# Altium schematic sheet Power System2.SchDoc
size A; SheetNumber: 1; SheetTotal: 1
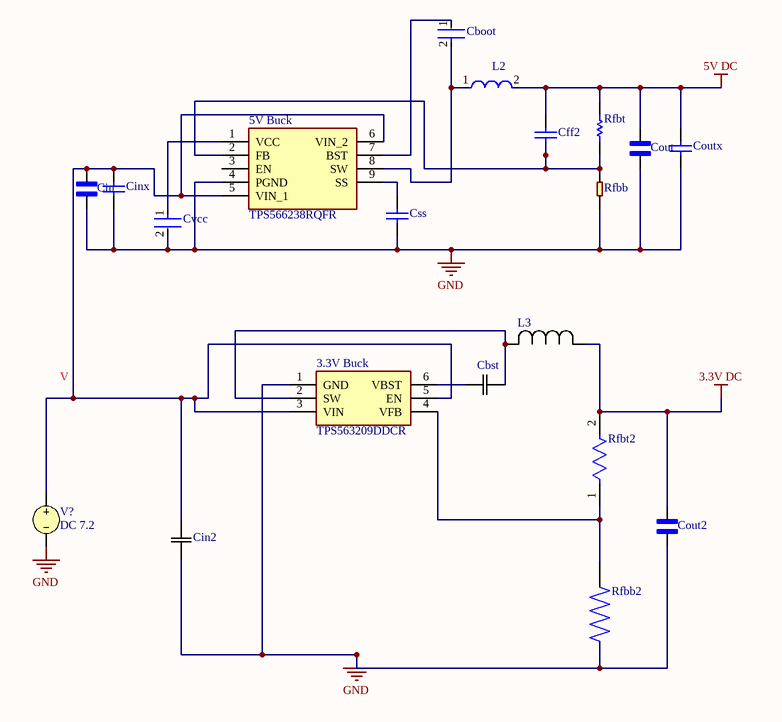
[diagram p0: Power System2.SchDoc]

## Parts
3.3V_Buck  TPS563209DDCR  [SOT95P280X110-6N]
5V_Buck  TPS566238RQFR  [TPS566238RQFR]
Cboot  GRM155R71C104KA88D  [FP-GRM15-MFG]  (value not drawn)
Cbst  08053C104KAT2A  [CAP_X7R_0805_AVX]  (value not drawn)
Cff2  06033A330JAT2A  [CAPC1608X90X35LL15T15]  (value not drawn)
Cin  MSASE21GBB5226MTNA01  [CAPC2012X145N]  (value not drawn)
Cin2  MSAST219LB5106KTNA01  [CAP_MSAS21-9_TAY]  (value not drawn)
Cinx  GRM188R71H104KA93D  [CAPC1608X90X35ML10T15]  (value not drawn)
Cout  LMK212BJ226MG-T  [CAPC2012X135N]  (value not drawn)
Cout2  GRM188R60J226MEA0D  [CAPC1608X100N]  (value not drawn)
Coutx  GRM188R71E104KA01D  [CAPC1608X90X35LL10T15]  (value not drawn)
Css  GRM155R71C103KA01D  [CAPC1005X55X25LL05T10]  (value not drawn)
Cvcc  EMK107B7105KA-T  [FP-0603-L_1_6_0_1-W_0_8_0-IPC_C]  (value not drawn)
L2  XAL5030-222MEB  [FP-XAL5030-222MEB-MFG]  (value not drawn)
L3  SRN8040-2R2Y  [IND_BOURNS_SRN8040]  (value not drawn)
Rfbb  SMD-RES-30K-1%-1/10W(0603)  [R0603]  (value not drawn)
Rfbb2  M55342K11B10E0RS3  [RESC0905X41N]  (value not drawn)
Rfbt  RC0603FR-07220KL  [RESC1608X55X25ML10T15]  (value not drawn)
Rfbt2  CRCW040233K2FKED  [Vishay_CRCW0402-e3_MFG]  (value not drawn)
V?  DC 7.2

## Nets
3.3V DC: Cout2.2 L3.1 Rfbt2.2
5V DC: Cff2.2 Cout.2 Coutx.2 L2.2 Rfbt.2
GND: 3.3V_Buck.1(GND) 5V_Buck.4(PGND) Cin.1 Cin2.1 Cinx.1 Cout.1 Cout2.1 Coutx.1 Css.1 Cvcc.2 Rfbb.1 Rfbb2.1 V?.2
Net3.3V_Buck_2: 3.3V_Buck.2(SW) Cbst.2 L3.2
Net3.3V_Buck_3: 3.3V_Buck.3(VIN) 3.3V_Buck.5(EN) 5V_Buck.5(VIN_1) 5V_Buck.6(VIN_2) Cin.2 Cin2.2 Cinx.2 V?.1
Net3.3V_Buck_4: 3.3V_Buck.4(VFB) Rfbb2.2 Rfbt2.1
Net3.3V_Buck_6: 3.3V_Buck.6(VBST) Cbst.1
Net5V_Buck_1: 5V_Buck.1(VCC) Cvcc.1
Net5V_Buck_2: 5V_Buck.2(FB) Cff2.1 Rfbb.2 Rfbt.1
Net5V_Buck_7: 5V_Buck.7(BST) Cboot.1
Net5V_Buck_8: 5V_Buck.8(SW) Cboot.2 L2.1
Net5V_Buck_9: 5V_Buck.9(SS) Css.2

Not connected (* = marked no-connect by the designer): 5V_Buck 3(EN)

## Library data of the parts
3.3V_Buck = CMP-006-000000-1: 17 V Input, 3A Synchronous Step-Down Regulator in SOT-23; Manufacturer_Name: Texas Instruments; Geometry.Height: 1.1mm; Datasheet Link: http://www.ti.com/lit/gpn/tps563209; Mouser Part Number: 595-TPS563209DDCR; Mouser Price/Stock: https://www.mouser.co.uk/ProductDetail/Texas-Instruments/TPS563209DDCR?qs=bT6MOr62zwIer%2FLlyIAhvQ%3D%3D; Source: TPS563209DDCR.SchLib; Manufacturer_Part_Number: TPS563209DDCR; Design Item ID: TPS563209DDCR
5V_Buck = CMP-009-000000-1: Switching Voltage Regulators 3-V to 18-V input, 6-A synchronous step-down regulator with forced continuous conduction mode 9-VQFN-HR -40 to 125; Manufacturer_Name: Texas Instruments; Geometry.Height: 1mm; Manufacturer_Part_Number: TPS566238RQFR; Mouser Price/Stock: https://www.mouser.co.uk/ProductDetail/Texas-Instruments/TPS566238RQFR?qs=stqOd1AaK7%252BIxOvIy4vX6A%3D%3D; Mouser Part Number: 595-TPS566238RQFR; Datasheet Link: https://www.ti.com/lit/ds/symlink/tps566238.pdf?ts=1674445033157&ref_url=https%253A%252F%252Fwww.ti.com%252Fproduct%252FTPS566238%252Fpart-details%252FTPS566238RQFR; Design Item ID: TPS566238RQFR; Source: TPS566238RQFR.SchLib
Cboot = CMP-2100-03641-2: CAP CER 0.1UF 16V X7R 0402; Manufacturer: Murata; Standoff Height: 0mm; Tolerance: 10%; Voltage Rating: 16Vdc; Capacitance: 0.10μF; Value: 0.10μF; RoHS: TRUE; Manufacturer Part Number: GRM155R71C104KA88D; Temperature Characteristic: X7R; Octopart: https://octopart.com/grm155r71c104ka88d-murata-196880; Digikey Description: CAP CER 0.1UF 16V X7R 0402; Device Class L3: Ceramic Capacitors; Height: 0.55mm; ComponentLink2Description: Datasheet; Temperature Range Low: -55°C; Ipc Land Pattern Name: CAPC10050X219; ComponentLink2URL: https://search.murata.co.jp/Ceramy/image/img/A01X/G101/ENG/GRM155R71H471KA01-01A.pdf; Device Class L1: Passive Components; Lead Free: yes; Category: Cap; Package: GRM15; Temperature: -55°C to +125°C; Device Class L2: Capacitors; Material: Ceramic; Temperature Range High: +125°C; Mouser Description: 0402 0.1 uF 16V ±10 % Tolerance X7R SMT Multilayer Ceramic Capacitor
Cbst = 08053C104KAT2A: Description; Manufacturer_Name: KYOCERA AVX; Copyright: Copyright (C) 2025 Ultra Librarian. All rights reserved.; Manufacturer_Part_Number: 08053C104KAT2A
Cff2 = CMP-2006-04137-1: Manufacturer: AVX Interconnect / Elco; Part Number: 06033A330JAT2A
Cin = MSASE21GBB5226MTNA01: MF: {'manufacturer': u'Taiyo Yuden'}; Package: None; Price: None; Value: *; MP: MSASE21GBB5226MTNA01; Availability: Unavailable
Cin2 = MSAST219LB5106KTNA01: Description; Manufacturer_Name: TAIYO YUDEN; Copyright: Copyright (C) 2025 Ultra Librarian. All rights reserved.; Manufacturer_Part_Number: MSAST219LB5106KTNA01
Cinx = CMP-2100-03643-1: Chip Capacitor, 0.1 uF, +/- 10%, 50 V, -55 to 125 degC, 0603 (1608 Metric), RoHS, Tape and Reel; Manufacturer: Murata; Dielectric Material: Ceramic; Voltage Rating: 50V; Capacitance: 100nF; Dielectric: X7R; Insulation Resistance: 10GR; Case Code (Metric): 1608; Lead Free: LeadFree; Depth: 0.8mm; Number of Pins: 2; Radiation Hardening: No; Case/Package: 0603; Manufacturer URL: http://www.murata.com/; Packaging: TapeandReel; Length: 1.6mm; Contact Plating: Tin; Datasheet URL: http://psearch.en.murata.com/capacitor/product/GRM188R71H104KA93%23.pdf; Tolerance: 10%; Case Code (Imperial): 0603; Min Operating Temperature: -55degC; RoHSCompliant: true; Voltage: 50V; Termination: SMD/SMT; Mount: SurfaceMount; Material: Ceramic; Package Quantity: 1; Height: 0.8mm; Thickness: 0.035inch; REACH SVHC: NoSVHC; Max Operating Temperature: 125degC; Width: 0.8mm; Package Reference: 0603; Voltage Rating (DC): 50V; Datasheet Version: 42675.0; Package Description: 2-Pin Surface Mount Device, Body 1.6 x 0.8 mm
Cout = LMK212BJ226MG-T: MP: altium_native_batch; Package: None; Price: None; Value: *; Availability: Unavailable
Cout2 = GRM188R60J226MEA0D: 22 ÂµF Â±20% 6.3V Ceramic Capacitor X5R 0603 (1608 Metric); MF: Murata; SnapEDA_Link: https://www.snapeda.com/parts/GRM188R60J226MEA0D/Murata/view-part/?ref=snap; Package: 1608 Murata; Value: *; MP: GRM188R60J226MEA0D; Check_prices: https://www.snapeda.com/parts/GRM188R60J226MEA0D/Murata/view-part/?ref=eda
Coutx = CMP-2006-02868-1: Manufacturer: Murata; Part Number: GRM188R71E104KA01D
Css = CMP-2000-06332-1: Chip Capacitor, 10 nF, 16 V, 10%, -55 to 125 degC, 0402 (1005 Metric), RoHS, Tape and Reel; Manufacturer: Murata; Rated Voltage: 16V; Capacitance: 10000pF; Dielectric: X7R; Manufacturer URL: http://www.murata.com/; Package Description: 2-Pin Surface Mount Device, Body 1 x 0.5 mm; Case Size/Dimension: 0402; Tolerance (%): ±10%; Datasheet Version: 06/2016; Package Reference: 0402; Mounting Technology: SurfaceMount; Datasheet URL: http://psearch.en.murata.com/capacitor/product/GRM155R71C103KA01%23.pdf
Cvcc = CMP-14477-000018-3: None; Voltage Rating (DC): 16V; Dielectric: X7R; Capacitance: 1uF; Tolerance: 10%; Halogen Free: Halogen Free; Height: 0.8mm; REACH SVHC: No SVHC; Contact Plating: Nickel; Number of Pins: 2; Resistor Type: Ceramic; Series: M; Thickness: 0.035inch; Construction: Flat; Voltage Rating: 16V; Packaging: Tape and Reel; Width: 0.031inch; Length: 1.6mm; Case Code (Metric): 1608; RoHS Compliant: Yes; Termination: SMD/SMT; Min Operating Temperature: -55°C; Case/Package: 0603; Mount: Surface Mount; Case Code (Imperial): 0603; Depth: 0.8mm; Package Quantity: 1; Max Operating Temperature: 125°C; Lead Free: Lead Free; Radiation Hardening: No
L2 = CMP-11268-000050-1: Fixed Inductors 2.2uH 20% 9.7A 14.5mOhms; DC Resistance (DCR): 14.5mR; Shielding: Shielded; Max DC Current: 9.2A; Test Frequency: 100kHz; Self Resonant Frequency: 38MHz; Core Material: Composite; Lead Free: Contains Lead; Inductance: 2.2uH; Max Operating Temperature: 125°C; Termination: SMD/SMT; Min Operating Temperature: -40°C; Height: 3.1mm; Package Quantity: 20; Packaging: Tape and Reel; Tolerance: 20%; Length: 5.68mm; Width: 5.48mm
L3 = SRN8040-2R2Y: Description; Manufacturer_Name: Bourns Electronics; Copyright: Copyright (C) 2025 Ultra Librarian. All rights reserved.; Manufacturer_Part_Number: SRN8040-2R2Y
Rfbb = SMD-RES-30K-1%-1/10W(0603): 30 kOhms Â±1% 0.1W, 1/10W Chip Resistor 0603 (1608 Metric) Moisture Resistant Thick Film; MF: Yageo; MP: RC0603FR-0730KL; Package: SMD-2 Yageo; Price: None; Check_prices: https://www.snapeda.com/parts/RC0603FR-0730KL/Yageo/view-part/?ref=eda; Value: *; SnapEDA_Link: https://www.snapeda.com/parts/RC0603FR-0730KL/Yageo/view-part/?ref=snap; Availability: In Stock; Purchase-URL: https://pricing.snapeda.com/search?q=RC0603FR-0730KL&ref=eda
Rfbt = CMP-1659-00037-1: Chip Resistor, 220 KOhm, +/- 1%, 100 mW, -55 to 155 degC, 0603 (1608 Metric), RoHS, Tape and Reel; Resistance: 0.1 Ohm; ComponentLink1Description: Manufacturer URL; ComponentLink2Description: Datasheet; ComponentLink1URL: http://www.yageo.com/; REACH SVHC: No SVHC; RoHSCompliant: true; DatasheetVersion: Rev. 4, 02/2016; Min Operating Temperature: -25 degC; Height: 0.25 inch; ComponentLink2URL: http://www.yageo.com/documents/recent/PYu-RC_Group_51_RoHS_L_04.pdf; PackageDescription: 2-Pin Surface Mount Device, Body 1.6 x 0.8 mm; Max Operating Temperature: 70 degC; Width: 0.25 inch; Length: 0.75 inch; PackageReference: 0603
Rfbt2 = CMP-2002-08529-2: NexarPartId: 39869749; Power Rating: 63mW; Temperature Coefficient: 100ppm/°C; Resistance: 33.2kΩ; Voltage Rating: 50V; Tolerance: 1%; REACH SVHC: Unknown; Number of Pins: 2; Military Standard: Not; Composition: Thick Film; Case Code (Imperial): 0402; Number of Terminations: 2; Lead Free: Lead Free; Case Code (Metric): 1005; Termination: SMD/SMT; Case/Package: 0402; Contact Plating: Tin; Height: 350µm; Min Operating Temperature: -55°C; Mount: Surface Mount; Max Operating Temperature: 155°C; Features: Automotive AEC-Q200; Length: 1mm; Weight: 652.039032µg; Packaging: Cut Tape; Schedule B: 8533210045, 8533210045; Voltage Rating (DC): 50V; Depth: 500µm; Max Power Dissipation: 63mW; RoHS: Compliant; Radiation Hardening: No; Width: 500µm
V? = VSRC: Voltage Source; Note: PCB Footprint - Not required; AC Magnitude: 1; AC Phase: 0; Value: 5; Published: 8-Jun-2000; LatestRevisionDate: 17-Jul-2002; LatestRevisionNote: Re-released for DXP Platform.; PackageReference: Not Applicable; Publisher: Altium Limited
Rfbb2 = M55342K11B10E0RS3: Package: None; Price: None; Value: *; MP: M55342K11B10E0RS3; Availability: Unavailable